# Altium project PRJ_Wash.PrjPcb
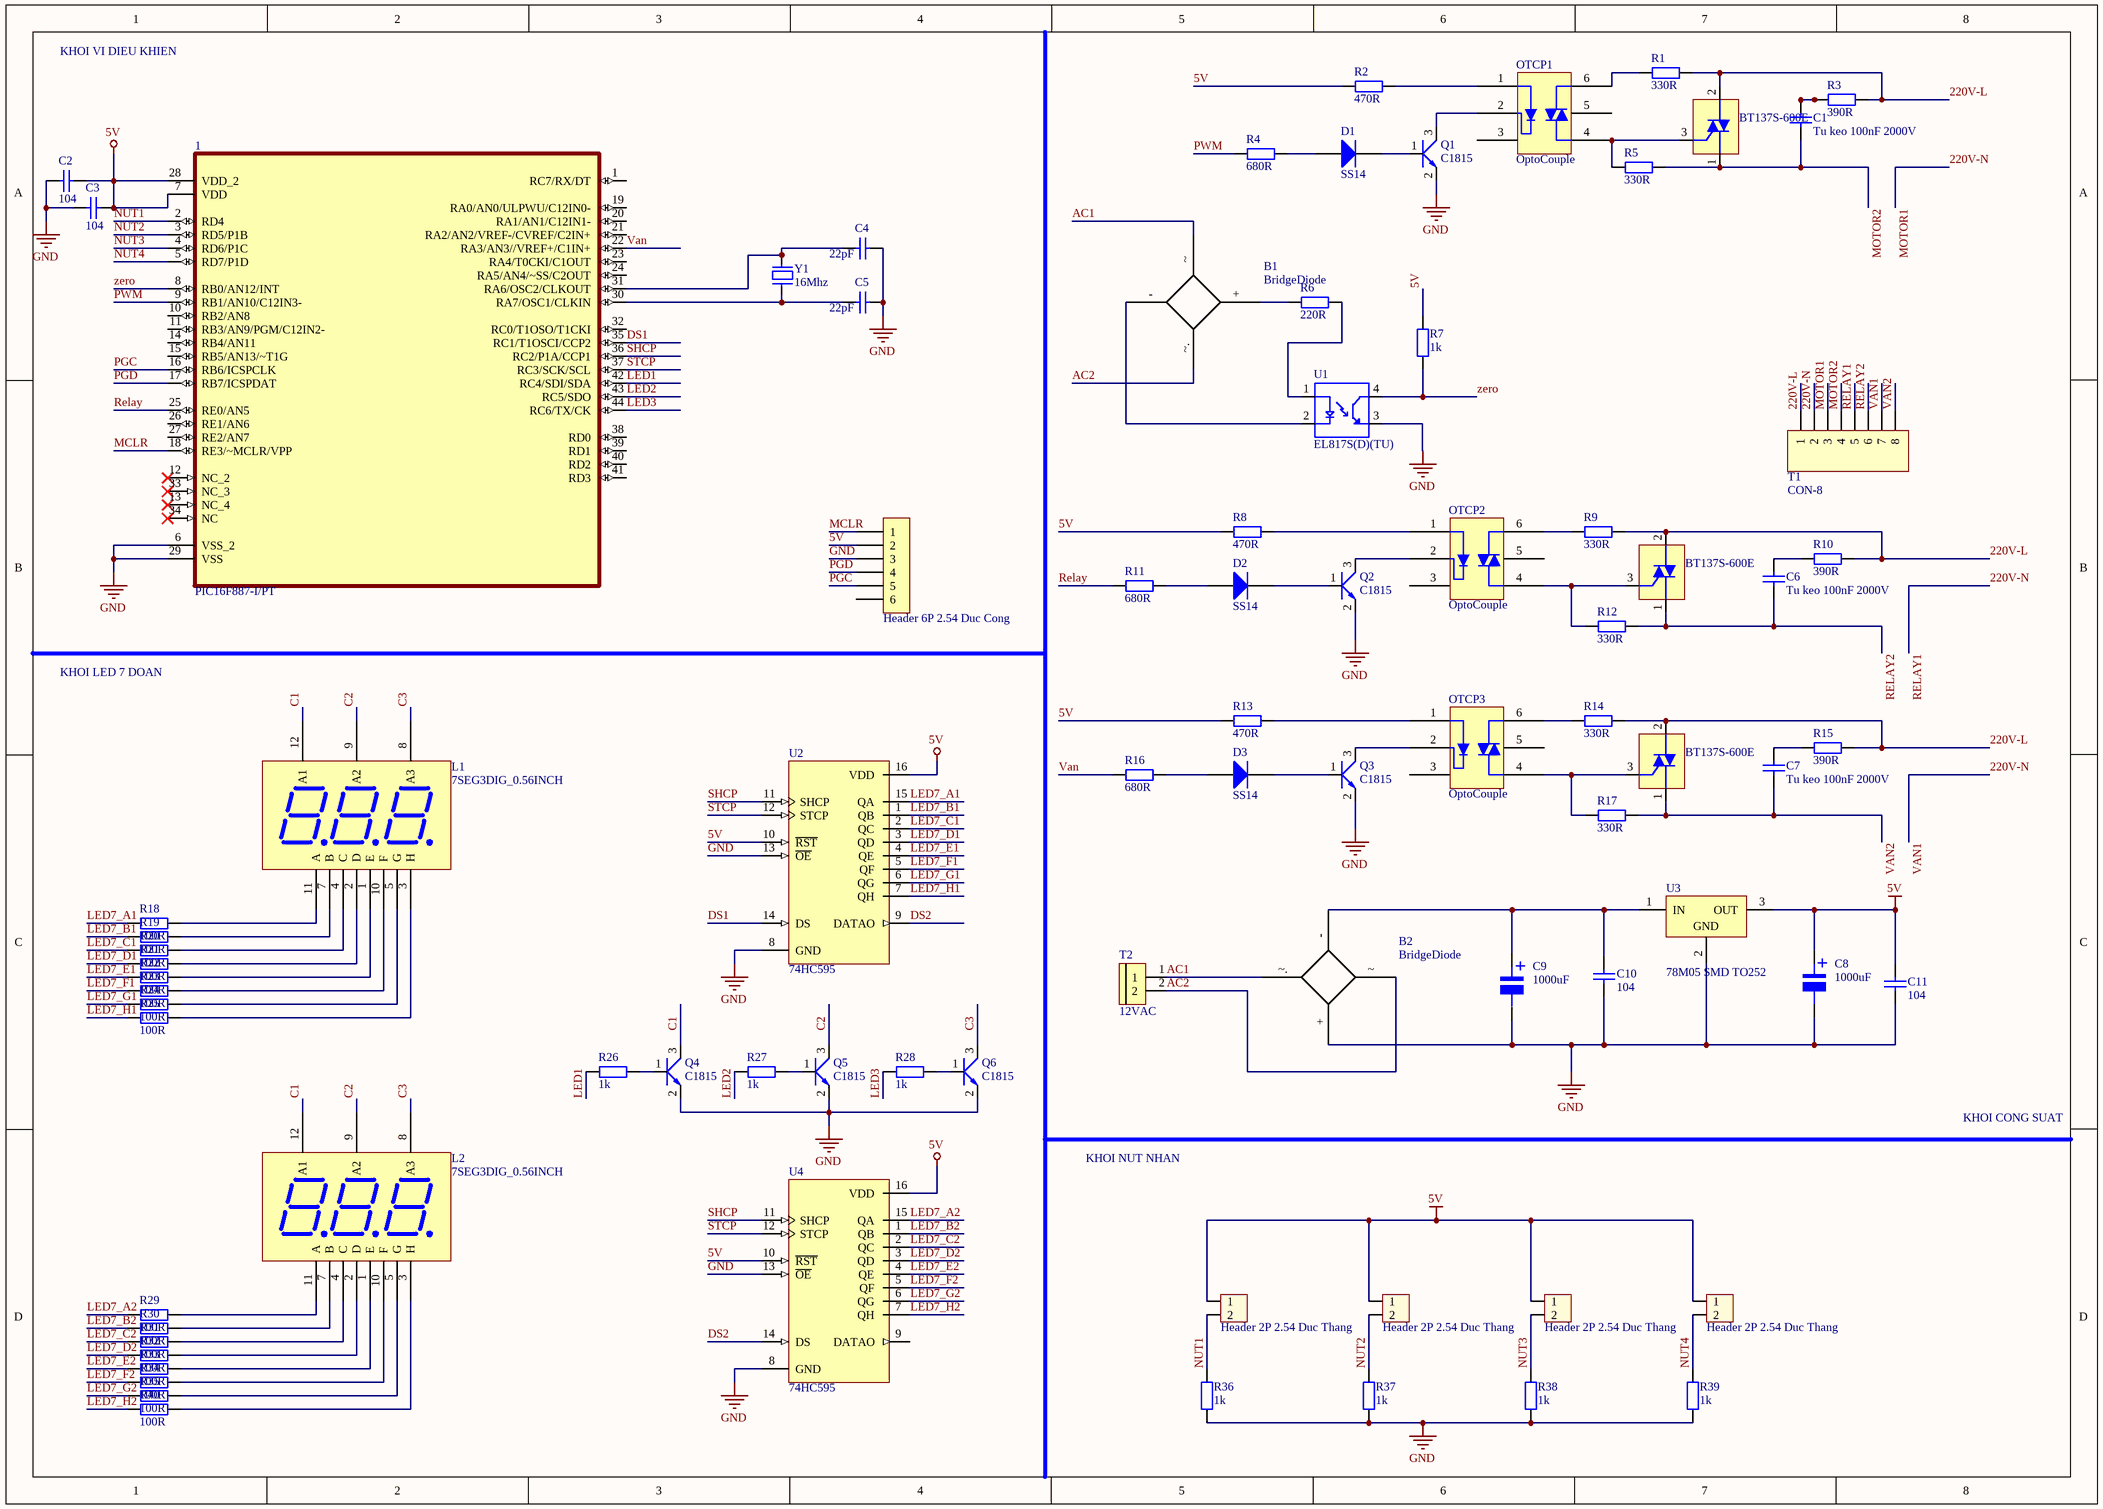
[diagram p0: SCH_Wash.SchDoc]
1 sheet, 83 parts. Net scope: global (net labels, ports and power ports of the same name join across sheets).
Board files: PCB_Wash.PcbDoc, PCB_WashVer2.PcbDoc

## Sheet SCH_Wash.SchDoc
size A3

### Parts
1  PIC16F887-I/PT  [QFP80P1200X1200X120-44N]
B1  BridgeDiode  [DIOB_DB107S]
B2  BridgeDiode  [KBP310]
BT1  BT137S-600E  [TO252_NEW]
BT2  BT137S-600E  [TO252_NEW]
BT3  BT137S-600E  [TO252_NEW]
C1  Tu keo 100nF 2000V  [TU KEO 25MM]
C2  104  [tu 0805]
C3  104  [tu 0805]
C4  22pF  [tu 0805]
C5  22pF  [tu 0805]
C6  Tu keo 100nF 2000V  [TU KEO 25MM]
C7  Tu keo 100nF 2000V  [TU KEO 25MM]
C8  1000uF  [tu nhom 10 (G)]
C9  1000uF  [tu nhom 10 (G)]
C10  104  [tu 0805]
C11  104  [tu 0805]
D1  SS14  [DIODE SMD]
D2  SS14  [DIODE SMD]
D3  SS14  [DIODE SMD]
H1  Header 6P 2.54 Duc Cong  [Header 6P DC 2.54]
H2  Header 2P 2.54 Duc Thang  [XH2.54M-2]
H3  Header 2P 2.54 Duc Thang  [XH2.54M-2]
H4  Header 2P 2.54 Duc Thang  [XH2.54M-2]
H5  Header 2P 2.54 Duc Thang  [XH2.54M-2]
L1  7SEG3DIG_0.56INCH  [7SEG_3DIGIT_0.56INCH]
L2  7SEG3DIG_0.56INCH  [7SEG_3DIGIT_0.56INCH]
OTCP1  OptoCouple  [OPTOCOUPLER_H11F3SR2M]
OTCP2  OptoCouple  [OPTOCOUPLER_H11F3SR2M]
OTCP3  OptoCouple  [OPTOCOUPLER_H11F3SR2M]
Q1  C1815  [SOT23B]
Q2  C1815  [SOT23B]
Q3  C1815  [SOT23B]
Q4  C1815  [SOT23B]
Q5  C1815  [SOT23B]
Q6  C1815  [SOT23B]
R1  330R  [Tro SMD 0805]
R2  470R  [Tro SMD 0805]
R3  390R  [Tro SMD 0805]
R4  680R  [tro smd 0805]
R5  330R  [Tro SMD 0805]
R6  220R  [tro smd 0805]
R7  1k  [tro smd 0805]
R8  470R  [Tro SMD 0805]
R9  330R  [Tro SMD 0805]
R10  390R  [Tro SMD 0805]
R11  680R  [tro smd 0805]
R12  330R  [Tro SMD 0805]
R13  470R  [Tro SMD 0805]
R14  330R  [Tro SMD 0805]
R15  390R  [Tro SMD 0805]
R16  680R  [tro smd 0805]
R17  330R  [Tro SMD 0805]
R18  100R  [tro smd 0805]
R19  100R  [tro smd 0805]
R20  100R  [tro smd 0805]
R21  100R  [tro smd 0805]
R22  100R  [tro smd 0805]
R23  100R  [tro smd 0805]
R24  100R  [tro smd 0805]
R25  100R  [tro smd 0805]
R26  1k  [tro smd 0805]
R27  1k  [tro smd 0805]
R28  1k  [tro smd 0805]
R29  100R  [tro smd 0805]
R30  100R  [tro smd 0805]
R31  100R  [tro smd 0805]
R32  100R  [tro smd 0805]
R33  100R  [tro smd 0805]
R34  100R  [tro smd 0805]
R35  100R  [tro smd 0805]
R36  1k  [tro smd 0805]
R37  1k  [tro smd 0805]
R38  1k  [tro smd 0805]
R39  1k  [tro smd 0805]
R40  100R  [tro smd 0805]
T1  CON-8  [TER_8P_8.25]
T2  12VAC  [CON_2P_5mm]
U1  EL817S(D)(TU)  [SOIC254P1030X460-4N]
U2  74HC595  [sop 16]
U3  78M05 SMD TO252  [TO252]
U4  74HC595  [sop 16]
Y1  16Mhz  [Thach Anh 2 chan SMD]

### Nets
5V: 1.7(VDD) 1.28(VDD_2) C2.1 C3.1 C8.1 C11.1 H1.2 H2.1 H3.1 H4.1 H5.1 R2.1 R7.2 R8.1 R13.1 U2.10(~{RST}) U2.16(VDD) U3.3(OUT) U4.10(~{RST}) U4.16(VDD)
GND: 1.6(VSS_2) 1.29(VSS) B2.+ C2.2 C3.2 C4.1 C5.1 C8.2 C9.2 C10.2 C11.2 H1.3 Q1.2(E) Q2.2(E) Q3.2(E) Q4.2(E) Q5.2(E) Q6.2(E) R36.1 R37.1 R38.1 R39.1 U1.3(ET) U2.8(GND) U2.13(~{OE}) U3.2(GND) U4.8(GND) U4.13(~{OE})
220V-L: BT1.2 BT2.2 BT3.2 R1.2 R3.1 R9.2 R10.1 R14.2 R15.1 T1.1
220V-N: T1.2 T1.3 T1.5 T1.7  [also labelled MOTOR1, RELAY1, VAN1]
AC1: B1.~ B2.~. T2.1
AC2: B1.~. B2.~ T2.2
C1: L1.12(A1) L2.12(A1) Q4.3(C)
C2: L1.9(A2) L2.9(A2) Q5.3(C)
C3: L1.8(A3) L2.8(A3) Q6.3(C)
DS1: 1.35(RC1/T1OSCI/CCP2) U2.14(DS)
DS2: U2.9(DATAO) U4.14(DS)
LED1: 1.42(RC4/SDI/SDA) R26.2
LED2: 1.43(RC5/SDO) R27.2
LED3: 1.44(RC6/TX/CK) R28.2
LED7_A1: R18.1 U2.15(QA)
LED7_A2: R29.1 U4.15(QA)
LED7_B1: R19.1 U2.1(QB)
LED7_B2: R30.1 U4.1(QB)
LED7_C1: R20.1 U2.2(QC)
LED7_C2: R31.1 U4.2(QC)
LED7_D1: R21.1 U2.3(QD)
LED7_D2: R32.1 U4.3(QD)
LED7_E1: R22.1 U2.4(QE)
LED7_E2: R33.1 U4.4(QE)
LED7_F1: R23.1 U2.5(QF)
LED7_F2: R34.1 U4.5(QF)
LED7_G1: R24.1 U2.6(QG)
LED7_G2: R35.1 U4.6(QG)
LED7_H1: R25.1 U2.7(QH)
LED7_H2: R40.1 U4.7(QH)
MCLR: 1.18(RE3/~MCLR/VPP) H1.1
MOTOR2: BT1.1 C1.2 R5.2 T1.4
NUT1: 1.2(RD4) H2.2 R36.2
NUT2: 1.3(RD5/P1B) H3.2 R37.2
NUT3: 1.4(RD6/P1C) H4.2 R38.2
NUT4: 1.5(RD7/P1D) H5.2 R39.2
PGC: 1.16(RB6/ICSPCLK) H1.5
PGD: 1.17(RB7/ICSPDAT) H1.4
PWM: 1.9(RB1/AN10/C12IN3-) R4.1
Relay: 1.25(RE0/AN5) R11.1
RELAY2: BT2.1 C6.2 R12.2 T1.6
SHCP: 1.36(RC2/P1A/CCP1) U2.11(SHCP) U4.11(SHCP)
STCP: 1.37(RC3/SCK/SCL) U2.12(STCP) U4.12(STCP)
Van: 1.22(RA3/AN3//VREF+/C1IN+) R16.1
VAN2: BT3.1 C7.2 R17.2 T1.8
zero: 1.8(RB0/AN12/INT) R7.1 U1.4(CT)
Net1_30: 1.30(RA7/OSC1/CLKIN) C5.2 Y1.1
Net1_31: 1.31(RA6/OSC2/CLKOUT) C4.2 Y1.2
NetB1_+: B1.+ R6.1
NetB1_-: B1.- U1.2(C)
NetB2_-: B2.- C9.1 C10.1 U3.1(IN)
NetBT1_3: BT1.3 OTCP1.4 R5.1
NetBT2_3: BT2.3 OTCP2.4 R12.1
NetBT3_3: BT3.3 OTCP3.4 R17.1
NetC1_1: C1.1 R3.2
NetC6_1: C6.1 R10.2
NetC7_1: C7.1 R15.2
NetD1_1: D1.1(A) R4.2
NetD1_2: D1.2(K) Q1.1(B)
NetD2_1: D2.1(A) R11.2
NetD2_2: D2.2(K) Q2.1(B)
NetD3_1: D3.1(A) R16.2
NetD3_2: D3.2(K) Q3.1(B)
NetL1_1: L1.1(E) R22.2
NetL1_2: L1.2(D) R21.2
NetL1_3: L1.3(H) R25.2
NetL1_4: L1.4(C) R20.2
NetL1_5: L1.5(G) R24.2
NetL1_7: L1.7(B) R19.2
NetL1_10: L1.10(F) R23.2
NetL1_11: L1.11(A) R18.2
NetL2_1: L2.1(E) R33.2
NetL2_2: L2.2(D) R32.2
NetL2_3: L2.3(H) R40.2
NetL2_4: L2.4(C) R31.2
NetL2_5: L2.5(G) R35.2
NetL2_7: L2.7(B) R30.2
NetL2_10: L2.10(F) R34.2
NetL2_11: L2.11(A) R29.2
NetOTCP1_1: OTCP1.1 R2.2
NetOTCP1_2: OTCP1.2 Q1.3(C)
NetOTCP1_6: OTCP1.6 R1.1
NetOTCP2_1: OTCP2.1 R8.2
NetOTCP2_2: OTCP2.2 Q2.3(C)
NetOTCP2_6: OTCP2.6 R9.1
NetOTCP3_1: OTCP3.1 R13.2
NetOTCP3_2: OTCP3.2 Q3.3(C)
NetOTCP3_6: OTCP3.6 R14.1
NetQ4_1: Q4.1(B) R26.1
NetQ5_1: Q5.1(B) R27.1
NetQ6_1: Q6.1(B) R28.1
NetR6_2: R6.2 U1.1(A)

Not connected (* = marked no-connect by the designer): 1 1(RC7/RX/DT) 10(RB2/AN8) 11(RB3/AN9/PGM/C12IN2-) 12(NC_2)* 13(NC_4)* 14(RB4/AN11) 15(RB5/AN13/~T1G) 19(RA0/AN0/ULPWU/C12IN0-) 20(RA1/AN1/C12IN1-) 21(RA2/AN2/VREF-/CVREF/C2IN+) 23(RA4/T0CKI/C1OUT) 24(RA5/AN4/~SS/C2OUT) 26(RE1/AN6) 27(RE2/AN7) 32(RC0/T1OSO/T1CKI) 33(NC_3)* 34(NC)* 38(RD0) 39(RD1) 40(RD2) 41(RD3); H1 6; OTCP1 3 5; OTCP2 3 5; OTCP3 3 5; U4 9(DATAO)

### Notes on the sheet
- KHOI VI DIEU KHIEN
- KHOI LED 7 DOAN
- KHOI CONG SUAT
- KHOI NUT NHAN
- (in symbol Tu Nhom 1000uF 16V) +

### Library data of the parts
1 = PIC16F887-I/PT: PIC PICÂ® 16F Microcontroller IC 8-Bit 20MHz 14KB _8K x 14_ FLASH 44-TQFP _10x10_; MF: Microchip; Package: TQFP-44 Microchip; Value: *; Price: None; MP: PIC16F887-I/PT; Availability: Unavailable; SnapEDA_Link: https://www.snapeda.com/parts/PIC16F887-I/PT/Microchip/view-part/5739/?ref=snap
B1 B2 = DIOB_Bridge
BT1-BT3 = BT137: Dán; Ten_Linh_Kien: BT137S-600E TO252 TRIAC 8A 600V; Don_Vi: Con; Ma_Hang: MH005450; Ghi_Chu: *; Kieu_Chan: *; Chung_Loai: Dán
C2 C3 C10 C11 = Tu 0805 104 50V 10%: Dán; Don_Vi: Con; So_Chan: 2; Ten_Linh_Kien: Tụ 0805 104-100nF 10% 50V; Ma_Hang: MH004551; Chung_Loai: Dán; Kieu_Chan: *
C4 C5 = Tu 0805 22pF 50V 10%: Dán; Don_Vi: Con; So_Chan: 2; Ten_Linh_Kien: Tụ 0805 22P 10% 50V; Ma_Hang: MH004560; Chung_Loai: Dán; Kieu_Chan: *
C8 C9 = Tu Nhom 1000uF 16V: Dán; Don_Vi: Con; So_Chan: 2; Ten_Linh_Kien: Tụ Nhôm 1000uF 16V 10x10MM; Ma_Hang: MH004419; Chung_Loai: Dán; Kieu_Chan: *
D1-D3 = Diode SS14 ( 1N5819): Dán; Ma_Hang: MH002211; Don_Vi: Con; Ten_Linh_Kien: Diode SS14 DO214 Schottky 1A 40V ( 1N5819 DO214); Chung_Loai: Dán; Ghi_Chu: *; Kieu_Chan: *
H1 = Header 6P 2.54 Duc Cong: Cắm; Ten_Linh_Kien: Header 6P XH2.54-6P Đực Cong; Don_Vi: Con; Ma_Hang: MH003363; Chung_Loai: Cắm
H2-H5 = Header 2P 2.54 Duc Thang: Cắm; Ten_Linh_Kien: Header 2P XH2.54-2P Đực Thẳng; Don_Vi: Con; Ma_Hang: MH001283; Chung_Loai: Cắm
OTCP1-OTCP3 = MOC3020SM
Q1-Q6 = C1815: Dán; Ten_Linh_Kien: C1815 SOT23 TRANS NPN 0.15A 50V (SMD-HF); Don_Vi: Con; Ma_Hang: MH000946; Ghi_Chu: *; Kieu_Chan: *; Chung_Loai: Dán
R1 R5 R9 R12 R14 R17 = Tro 0805 5% 330R: Dán; Don_Vi: Con; So_Chan: 2; Ten_Linh_Kien: Trở 0805 5% 330R; Ma_Hang: MH005337; Chung_Loai: Dán; Kieu_Chan: *
R2 R8 R13 = Tro 0805 5% 470R: Dán; Don_Vi: Con; Ma_Hang: MH005341; Ten_Linh_Kien: Trở 0805 5% 470R; So_Chan: 2; Chung_Loai: Dán; Kieu_Chan: *
R3 R10 R15 = Tro 0805 5% 390R: Dán; Don_Vi: Con; So_Chan: 2; Ten_Linh_Kien: Trở 0805 5% 390R; Ma_Hang: MH005339; Chung_Loai: Dán; Kieu_Chan: *
R4 R11 R16 = Tro 0805 1% 680R: Dán; Don_Vi: Con; So_Chan: 2; Ten_Linh_Kien: Trở 0805 1% 680R; Ma_Hang: MH005487; Chung_Loai: Dán; Kieu_Chan: *
R6 = Tro 0805 5% 220R: Dán; Don_Vi: Con; So_Chan: 2; Ten_Linh_Kien: Trở 0805 5% 220R; Ma_Hang: MH005259; Chung_Loai: Dán; Kieu_Chan: *
R7 R26-R28 R36-R39 = Tro 0805 1% 1k: Dán; Don_Vi: Con; So_Chan: 2; Ten_Linh_Kien: Trở 0805 1% 1k; Ma_Hang: MH005468; Chung_Loai: Dán; Kieu_Chan: *
R18-R25 R29-R35 R40 = Tro 0805 5% 100R: Dán; Don_Vi: Con; So_Chan: 2; Ten_Linh_Kien: Trở 0805 5% 100R; Ma_Hang: MH005251; Chung_Loai: Dán; Kieu_Chan: *
T2 = CONNECT
U1 = EL817S(D)(TU): Optoisolator Transistor Output 5000Vrms 1 Channel 4-SMD; MF: Everlight Electronics; MP: EL817S_D__TU_; Package: SMD-4 Everlight Electronics; Value: *; Availability: Unavailable; SnapEDA_Link: https://www.snapeda.com/parts/EL817S_D__TU_/Everlight%20Electronics%20Co%20Ltd/view-part/1118456/?ref=snap; Price: None
U2 U4 = 74HC595: Dán; Ten_Linh_Kien: 74HC595D SOP16; Don_Vi: Con; Ma_Hang: MH000672; Ghi_Chu: *; Kieu_Chan: *; Chung_Loai: Dán
U3 = 78M05 SMD TO252: Dán; Don_Vi: Con; Ten_Linh_Kien: 78M05 TO252; Ma_Hang: MH001917; Ghi_Chu: *; Kieu_Chan: *; Chung_Loai: Dán
Y1 = Thach Anh 2 chan SMD: Crystal For all Crystal 2pin.; Value: 4Mhz